# Altium schematic sheet PLCfilters.SchDoc
size B
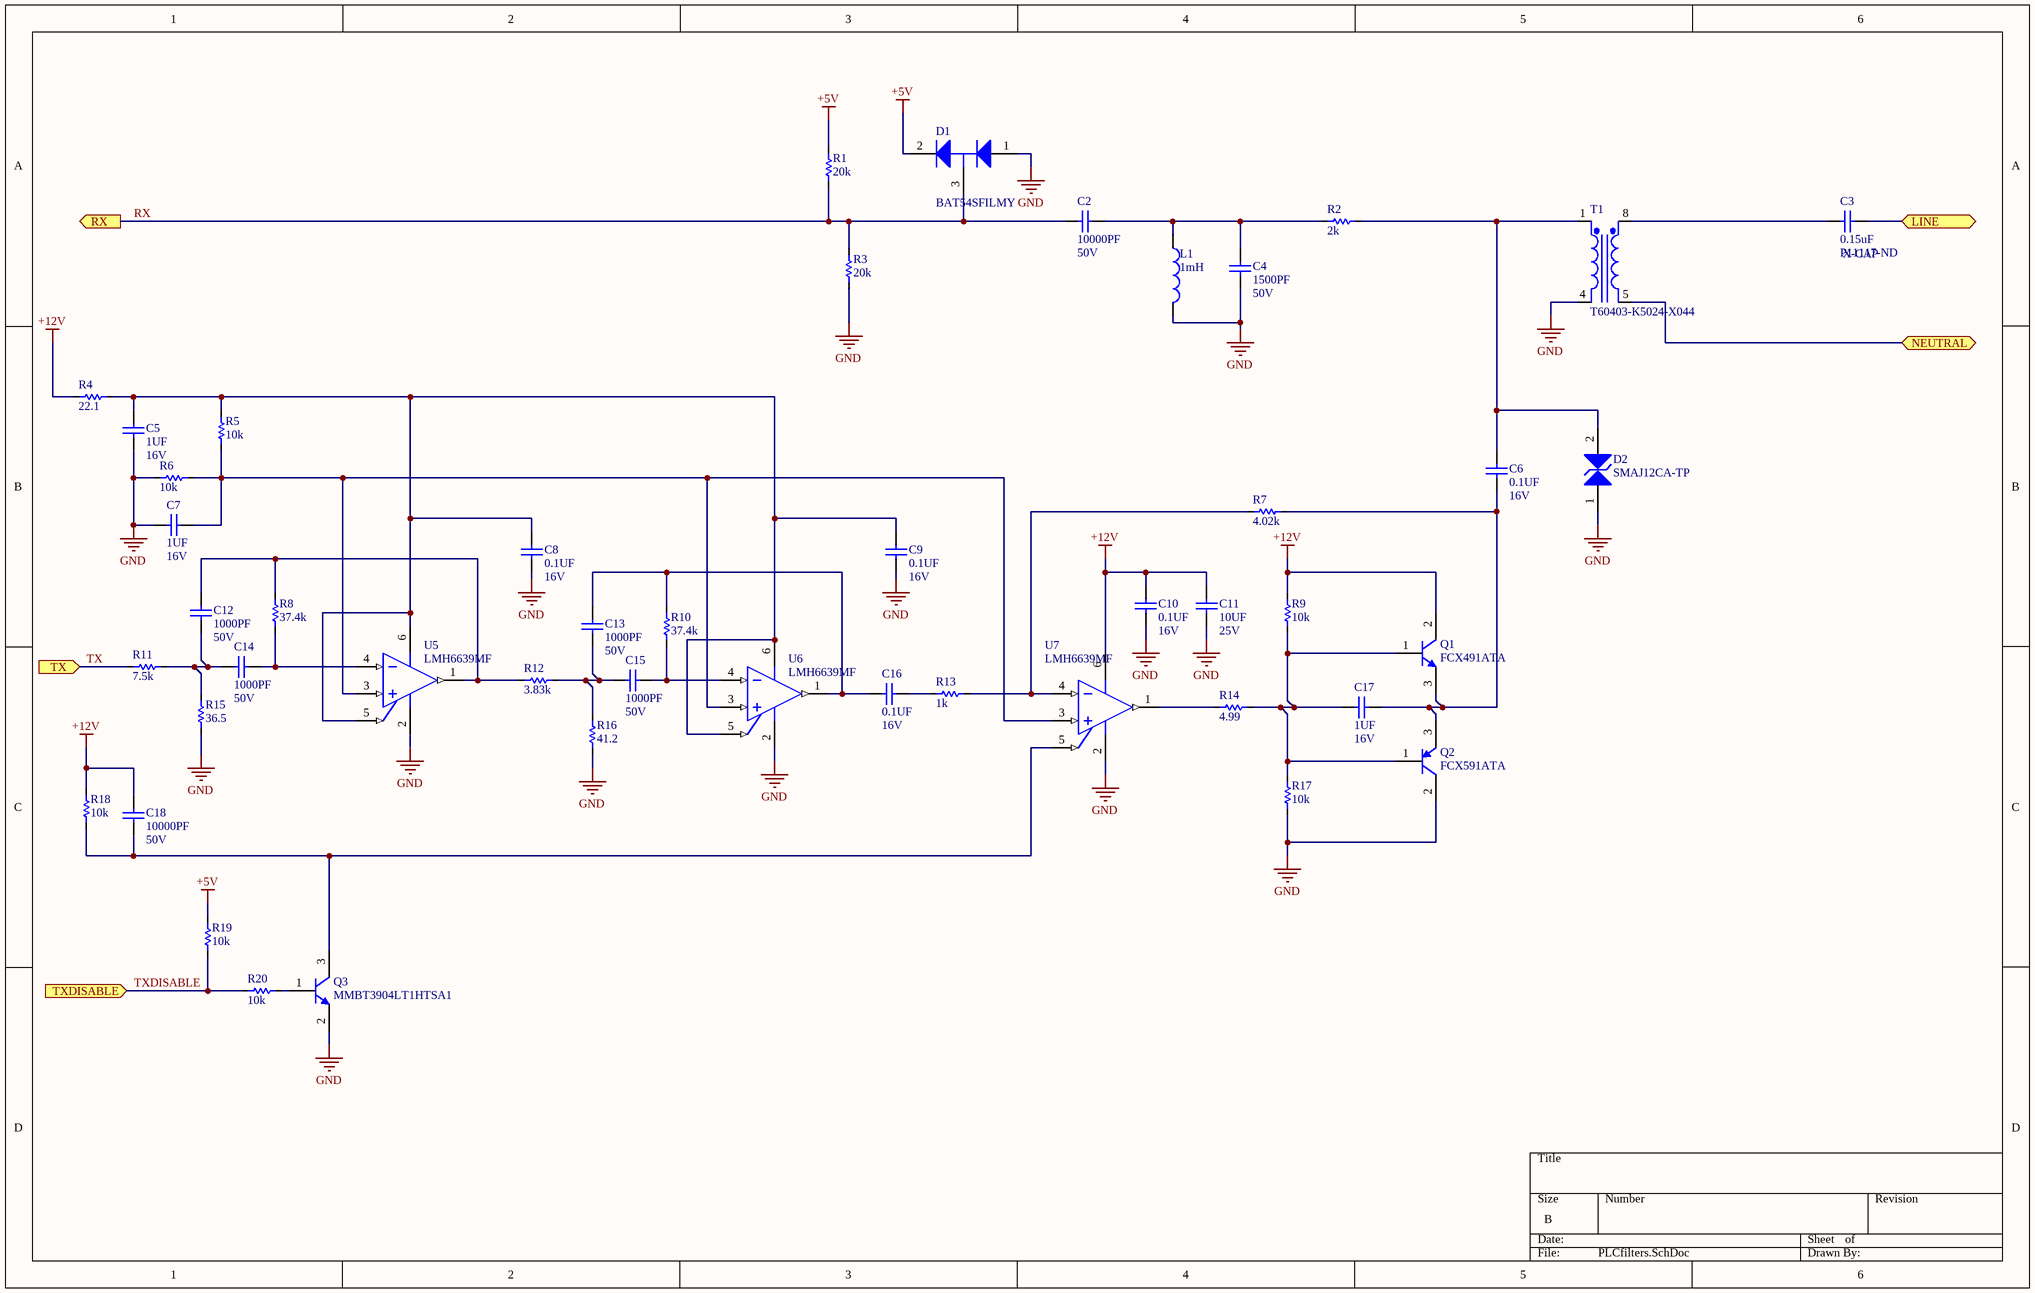
[diagram p0: PLCfilters.SchDoc]

## Parts
C2  Capacitance: 10000PF  Voltage - Rated: 50V  [CAPC1608X08N]  (hidden comment: GRM188R71H103KA01D)
C3  value 0.15uF  Supplier Part Number 1: P11117-ND  [ECQ-U3A154MG]  (hidden comment: ECQ-U3A154MG)
C4  Capacitance: 1500PF  Voltage - Rated: 50V  [CAPC1608X08N]  (hidden comment: GRM188R71H152KA01D)
C5  Capacitance: 1UF  Voltage - Rated: 16V  [CAPC1608X08N]  (hidden comment: GRM188R71C105KE15D)
C6  Capacitance: 0.1UF  Voltage - Rated: 16V  [CAPC1608X08N]  (hidden comment: GRM188R71C104KA01D)
C7  Capacitance: 1UF  Voltage - Rated: 16V  [CAPC1608X08N]  (hidden comment: GRM188R71C105KE15D)
C8  Capacitance: 0.1UF  Voltage - Rated: 16V  [CAPC1608X08N]  (hidden comment: GRM188R71C104KA01D)
C9  Capacitance: 0.1UF  Voltage - Rated: 16V  [CAPC1608X08N]  (hidden comment: GRM188R71C104KA01D)
C10  Capacitance: 0.1UF  Voltage - Rated: 16V  [CAPC1608X08N]  (hidden comment: GRM188R71C104KA01D)
C11  Capacitance: 10UF  Voltage - Rated: 25V  [CAPC3216X16N]  (hidden comment: GRM319R61E106KA12D)
C12  Capacitance: 1000PF  Voltage - Rated: 50V  [CAPC1608X08N]  (hidden comment: GRM1885C1H102JA01D)
C13  Capacitance: 1000PF  Voltage - Rated: 50V  [CAPC1608X08N]  (hidden comment: GRM1885C1H102JA01D)
C14  Capacitance: 1000PF  Voltage - Rated: 50V  [CAPC1608X08N]  (hidden comment: GRM1885C1H102JA01D)
C15  Capacitance: 1000PF  Voltage - Rated: 50V  [CAPC1608X08N]  (hidden comment: GRM1885C1H102JA01D)
C16  Capacitance: 0.1UF  Voltage - Rated: 16V  [CAPC1608X08N]  (hidden comment: GRM188R71C104KA01D)
C17  Capacitance: 1UF  Voltage - Rated: 16V  [CAPC1608X08N]  (hidden comment: GRM188R71C105KE15D)
C18  Capacitance: 10000PF  Voltage - Rated: 50V  [CAPC1608X08N]  (hidden comment: GRM188R71H103KA01D)
D1  BAT54SFILMY  [SOT95P240X110-3N]
D2  SMAJ12CA-TP  [DO-214AC]
L1  value 1mH  [INDC2518X20N]  (hidden comment: CB2518T102K)
Q1  FCX491ATA  [SOT89-150P409X160-3N]
Q2  FCX591ATA  [SOT89-150P409X160-3N]
Q3  MMBT3904LT1HTSA1  [SOT95P240X110-3N]
R1  Resistance: 20k  [RESC1608X06N]  (hidden comment: RC0603FR-0720KL)
R2  Resistance: 2k  [RESC1608X06N]  (hidden comment: RC0603FR-072KL)
R3  Resistance: 20k  [RESC1608X06N]  (hidden comment: RC0603FR-0720KL)
R4  Resistance: 22.1  [RESC1608X06N]  (hidden comment: RC0603FR-0722R1L)
R5  Resistance: 10k  [RESC1608X06N]  (hidden comment: RC0603FR-0710KL)
R6  Resistance: 10k  [RESC1608X06N]  (hidden comment: RC0603FR-0710KL)
R7  Resistance: 4.02k  [RESC1608X06N]  (hidden comment: RC0603FR-074K02L)
R8  Resistance: 37.4k  [RESC1608X06N]  (hidden comment: RC0603FR-0737K4L)
R9  Resistance: 10k  [RESC1608X06N]  (hidden comment: RC0603FR-0710KL)
R10  Resistance: 37.4k  [RESC1608X06N]  (hidden comment: RC0603FR-0737K4L)
R11  Resistance: 7.5k  [RESC1608X06N]  (hidden comment: AC0603FR-077K5L)
R12  Resistance: 3.83k  [RESC1608X06N]  (hidden comment: RC0603FR-073K83L)
R13  Resistance: 1k  [RESC1608X06N]  (hidden comment: RC0603FR-071KL)
R14  Resistance: 4.99  [RESC1608X06N]  (hidden comment: RC0603FR-074R99L)
R15  Resistance: 36.5  [RESC1608X06N]  (hidden comment: RC0603FR-0736R5L)
R16  Resistance: 41.2  [RESC1608X06N]  (hidden comment: RC0603FR-0741R2L)
R17  Resistance: 10k  [RESC1608X06N]  (hidden comment: RC0603FR-0710KL)
R18  Resistance: 10k  [RESC1608X06N]  (hidden comment: RC0603FR-0710KL)
R19  Resistance: 10k  [RESC1608X06N]  (hidden comment: RC0603FR-0710KL)
R20  Resistance: 10k  [RESC1608X06N]  (hidden comment: RC0603FR-0710KL)
T1  T60403-K5024-X044  [T60403-K5024-X044]
U5  LMH6639MF  [SOT95P280X145-6N]
U6  LMH6639MF  [SOT95P280X145-6N]
U7  LMH6639MF  [SOT95P280X145-6N]

## Ports
LINE (bidir), NEUTRAL (bidir), RX (out), TX (in), TXDISABLE (in)

## Nets
+5V: D1.2(K) R1.2 R19.2
+12V: C10.2 C11.2 C18.2 Q1.2(C) R4.1 R9.2 R18.2 U7.6(V+)
GND: C4.1 C5.1 C7.2 C8.1 C9.1 C10.1 C11.1 D1.1(A) D2.1(A) L1.2 Q2.2(C) Q3.2(E) R3.1 R6.1 R15.1 R16.1 R17.1 T1.4(Pri-) U5.2(V-) U6.2(V-) U7.2(V-)
LINE: C3.1 ; port LINE
NEUTRAL: T1.5(Sec-) ; port NEUTRAL
RX: C2.2 D1.3(C) R1.1 R3.2 ; port RX
TX: R11.1 ; port TX
TXDISABLE: R19.1 R20.2 ; port TXDISABLE
NetC2_1: C2.1 C4.2 L1.1 R2.1
NetC3_2: C3.2 T1.8(Sec+)
NetC5_2: C5.2 C8.2 C9.2 R4.2 R5.2 U5.5(nSD) U5.6(V+) U6.5(nSD) U6.6(V+)
NetC6_1: C6.1 C17.2 Q1.3(E) Q2.3(E) R7.2
NetC6_2: C6.2 D2.2(K) R2.2 T1.1(Pri+)
NetC7_1: C7.1 R5.1 R6.2 U5.3(IN+) U6.3(IN+) U7.3(IN+)
NetC12_1: C12.1 C14.1 R11.2 R15.2
NetC12_2: C12.2 R8.2 R12.1 U5.1(OUT)
NetC13_1: C13.1 C15.1 R12.2 R16.2
NetC13_2: C13.2 C16.1 R10.2 U6.1(OUT)
NetC14_2: C14.2 R8.1 U5.4(IN-)
NetC15_2: C15.2 R10.1 U6.4(IN-)
NetC16_2: C16.2 R13.1
NetC17_1: C17.1 Q1.1(B) Q2.1(B) R9.1 R14.2 R17.2
NetC18_1: C18.1 Q3.3(C) R18.1 U7.5(nSD)
NetQ3_1: Q3.1(B) R20.1
NetR7_1: R7.1 R13.2 U7.4(IN-)
NetR14_1: R14.1 U7.1(OUT)

## Notes on the sheet
- (near C3) X-CAP

## Library data of the parts
C2 C18 = GRM188R71H103KA01D: CAP CER 10000PF 50V X7R 0603; Manufacturer: Murata Electronics North America; Manufacturer Part Number: GRM188R71H103KA01D; Supplier 1: Digi-Key; Supplier Part Number 1: 490-1512-1-ND
C3 = ECQ-U3A154MG: CAP FILM 0.15UF 20% 300VAC RAD; Manufacturer: Murata; Manufacturer Part Number: ECQ-U3A154MG; Supplier 1: Digi-Key
C4 = GRM188R71H152KA01D: CAP CER 1500PF 50V X7R 0603; Manufacturer: Murata Electronics North America; Manufacturer Part Number: GRM188R71H152KA01D; Supplier 1: Digi-Key; Supplier Part Number 1: 490-1498-1-ND
C5 C7 C17 = GRM188R71C105KE15D: CAP CER 1UF 16V X7R 0603; Manufacturer: Murata Electronics North America; Manufacturer Part Number: GRM188R71C105KE15D; Supplier 1: Digi-Key; Supplier Part Number 1: 490-10734-1-ND
C6 C8-C10 C16 = GRM188R71C104KA01D: CAP CER 0.1UF 16V X7R 0603; Manufacturer: Murata Electronics North America; Manufacturer Part Number: GRM188R71C104KA01D; Supplier 1: Digi-Key; Supplier Part Number 1: 490-1532-1-ND
C11 = GRM319R61E106KA12D: CAP CER 10UF 25V X5R 1206; Manufacturer: Murata Electronics North America; Manufacturer Part Number: GRM319R61E106KA12D; Supplier 1: Digi-Key; Supplier Part Number 1: 490-5525-1-ND
C12-C15 = GRM1885C1H102JA01D: CAP CER 1000PF 50V C0G/NP0 0603; Manufacturer: Murata Electronics North America; Manufacturer Part Number: GRM1885C1H102JA01D; Supplier 1: Digi-Key; Supplier Part Number 1: 490-1451-1-ND
D1 = BAT54SFILMY: DIODE ARRAY SCHOTTKY 40V SOT23-3; Manufacturer: STMicroelectronics; Manufacturer Part Number: BAT54SFILMY; Supplier 1: Digi-Key; Supplier Part Number 1: 497-12132-1-ND
D2 = SMAJ12CA-TP: TVS DIODE 12VWM 19.9VC SMA; Manufacturer: Micro Commercial Co; Manufacturer Part Number: SMAJ12CA-TP; Supplier 1: Digi-Key; Supplier Part Number 1: SMAJ12CA-TPMSCT-ND
L1 = CB2518T102K: FIXED IND 1MH 75MA 31.2 OHM SMD; Manufacturer: Taiyo Yuden; Manufacturer Part Number: CB2518T102K; Supplier 1: Digi-Key; Supplier Part Number 1: 587-2195-1-ND
Q1 = FCX491ATA: TRANS NPN 40V 1A SOT-89; Manufacturer: Diodes Incorporated; Manufacturer Part Number: FCX491ATA; Supplier 1: Digi-Key; Supplier Part Number 1: FCX491ACT-ND
Q2 = FCX591ATA: TRANS PNP 40V 1A SOT-89; Manufacturer: Diodes Incorporated; Manufacturer Part Number: FCX591ATA; Supplier 1: Digi-Key; Supplier Part Number 1: FCX591ACT-ND
Q3 = MMBT3904LT1HTSA1: TRANS NPN 40V 0.2A SOT-23; Manufacturer: Infineon Technologies; Manufacturer Part Number: MMBT3904LT1HTSA1; Supplier 1: Digi-Key; Supplier Part Number 1: MMBT3904LT1HTSA1CT-ND
R1 R3 = RC0603FR-0720KL: RES SMD 20K OHM 1% 1/10W 0603; Manufacturer: Yageo; Manufacturer Part Number: RC0603FR-0720KL; Supplier 1: Digi-Key; Supplier Part Number 1: 311-20.0KHRCT-ND
R2 = RC0603FR-072KL: RES SMD 2K OHM 1% 1/10W 0603; Manufacturer: Yageo; Manufacturer Part Number: RC0603FR-072KL; Supplier 1: Digi-Key; Supplier Part Number 1: 311-2.00KHRCT-ND
R4 = RC0603FR-0722R1L: RES SMD 22.1 OHM 1% 1/10W 0603; Manufacturer: Yageo; Manufacturer Part Number: RC0603FR-0722R1L; Supplier 1: Digi-Key; Supplier Part Number 1: 311-22.1HRCT-ND
R5 R6 R9 R17-R20 = RC0603FR-0710KL: RES SMD 10K OHM 1% 1/10W 0603; Manufacturer: Yageo; Manufacturer Part Number: RC0603FR-0710KL; Supplier 1: Digi-Key; Supplier Part Number 1: 311-10.0KHRCT-ND
R7 = RC0603FR-074K02L: RES SMD 4.02K OHM 1% 1/10W 0603; Manufacturer: Yageo; Manufacturer Part Number: RC0603FR-074K02L; Supplier 1: Digi-Key; Supplier Part Number 1: 311-4.02KHRCT-ND
R8 R10 = RC0603FR-0737K4L: RES SMD 37.4K OHM 1% 1/10W 0603; Manufacturer: Yageo; Manufacturer Part Number: RC0603FR-0737K4L; Supplier 1: Digi-Key; Supplier Part Number 1: 311-37.4KHRCT-ND
R11 = AC0603FR-077K5L: RES SMD 7.5K OHM 1% 1/10W 0603; Manufacturer: Yageo; Manufacturer Part Number: AC0603FR-077K5L; Supplier 1: Digi-Key; Supplier Part Number 1: 311-36.5HRCT-ND
R12 = RC0603FR-073K83L: RES SMD 3.83K OHM 1% 1/10W 0603; Manufacturer: Yageo; Manufacturer Part Number: RC0603FR-073K83L; Supplier 1: Digi-Key; Supplier Part Number 1: 311-3.83KHRCT-ND
R13 = RC0603FR-071KL: RES SMD 1K OHM 1% 1/10W 0603; Manufacturer: Yageo; Manufacturer Part Number: RC0603FR-0710K7L; Supplier 1: Digi-Key; Supplier Part Number 1: 311-1.00KHRCT-ND
R14 = RC0603FR-074R99L: RES SMD 4.99 OHM 1% 1/10W 0603; Manufacturer: Yageo; Manufacturer Part Number: RC0603FR-074R99L; Supplier 1: Digi-Key; Supplier Part Number 1: 311-4.99HRCT-ND
R15 = RC0603FR-0736R5L: RES SMD 36.5 OHM 1% 1/10W 0603; Manufacturer: Yageo; Manufacturer Part Number: RC0603FR-0736R5L; Supplier 1: Digi-Key; Supplier Part Number 1: 311-36.5HRCT-ND
R16 = RC0603FR-0741R2L: RES SMD 41.2 OHM 1% 1/10W 0603; Manufacturer: Yageo; Manufacturer Part Number: RC0603FR-0741R2L; Supplier 1: Digi-Key; Supplier Part Number 1: 311-41.2HRCT-ND
T1 = T60403-K5024-X044: Audio Transformers / Signal Transformers PLC Transf PTH SMD 1.4mH 1:1; Manufacturer: Vacuumschmelze; Manufacturer Part Number: T60403-K5024-X044; Supplier 1: Mouser; Supplier Part Number 1: 983-T60403-K5024X044
U5-U7 = LMH6639MF: IC OPAMP VFB 90MHZ RRO SOT23-6; Manufacturer: Texas Instruments; Manufacturer Part Number: LMH6639MF; Supplier 1: Digi-Key; Supplier Part Number 1: LMH6639MFCT-ND